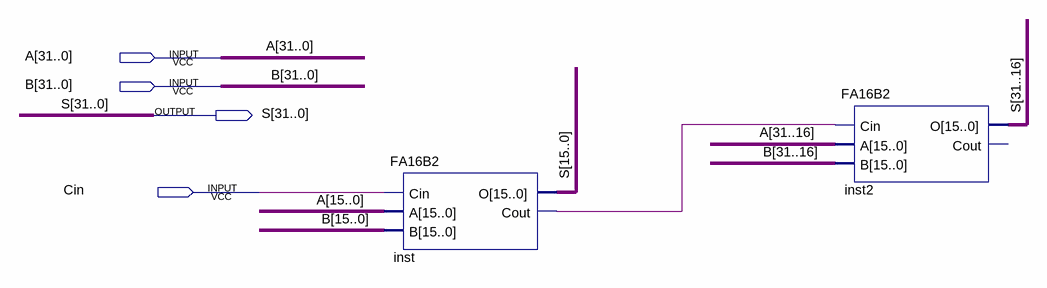
[diagram p0: schematic sheet]
// Quartus schematic FA32b.bdf as structural Verilog: 2 symbols, 4 pins
module FA32b (
  input  [31:0] A,
  input  [31:0] B,
  input  Cin,
  output [31:0] S
);

  wire inst_cout;

  FA16B2 inst (.Cin(Cin), .A(A[15:0]), .B(B[15:0]), .O(S[15:0]), .Cout(inst_cout));
  FA16B2 inst2 (.Cin(inst_cout), .A(A[31:16]), .B(B[31:16]), .O(S[31:16]));  // open: Cout
endmodule
